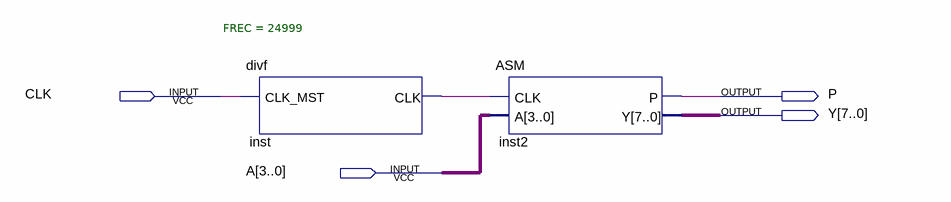
[diagram p0: schematic sheet]
// Quartus schematic practica07.bdf as structural Verilog: 2 symbols, 4 pins
module practica07 (
  input  CLK,
  input  [3:0] A,
  output P,
  output [7:0] Y
);

  wire inst_clk;

  divf #(.FREC(24999)) inst (.CLK_MST(CLK), .CLK(inst_clk));
  ASM inst2 (.CLK(inst_clk), .A(A), .P(P), .Y(Y));
endmodule
